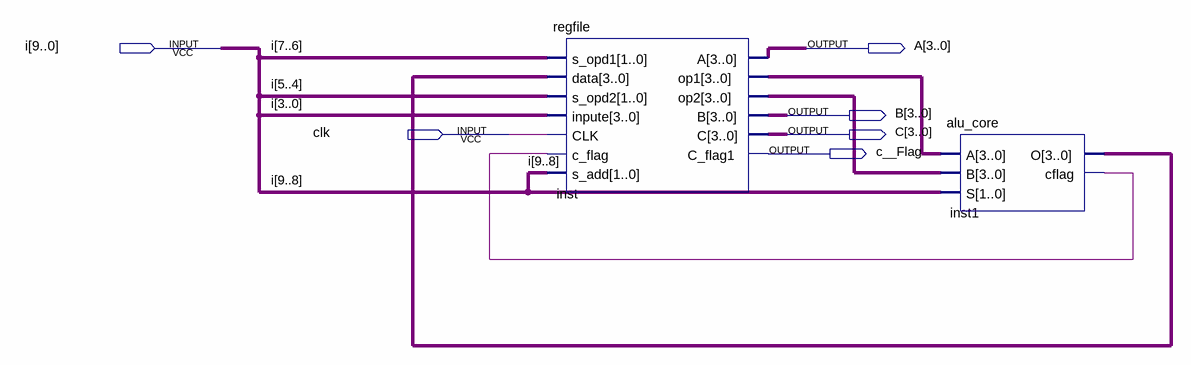
[diagram p0: schematic sheet]
// Quartus schematic alu.bdf as structural Verilog: 2 symbols, 6 pins
module alu (
  input  [9:0] i,
  input  clk,
  output [3:0] A,
  output [3:0] B,
  output [3:0] C,
  output c__Flag
);

  wire inst1_cflag;
  wire [3:0] inst1_o, inst_op1, inst_op2;

  regfile inst (
    .s_opd1(i[7:6]), .data(inst1_o), .s_opd2(i[5:4]), .inpute(i[3:0]), .CLK(clk), .c_flag(inst1_cflag),
    .s_add(i[9:8]), .A(A), .op1(inst_op1), .op2(inst_op2), .B(B), .C(C), .C_flag1(c__Flag));
  alu_core inst1 (.A(inst_op1), .B(inst_op2), .S(i[9:8]), .O(inst1_o), .cflag(inst1_cflag));
endmodule
